# Altium schematic sheet Main.SchDoc
size A4
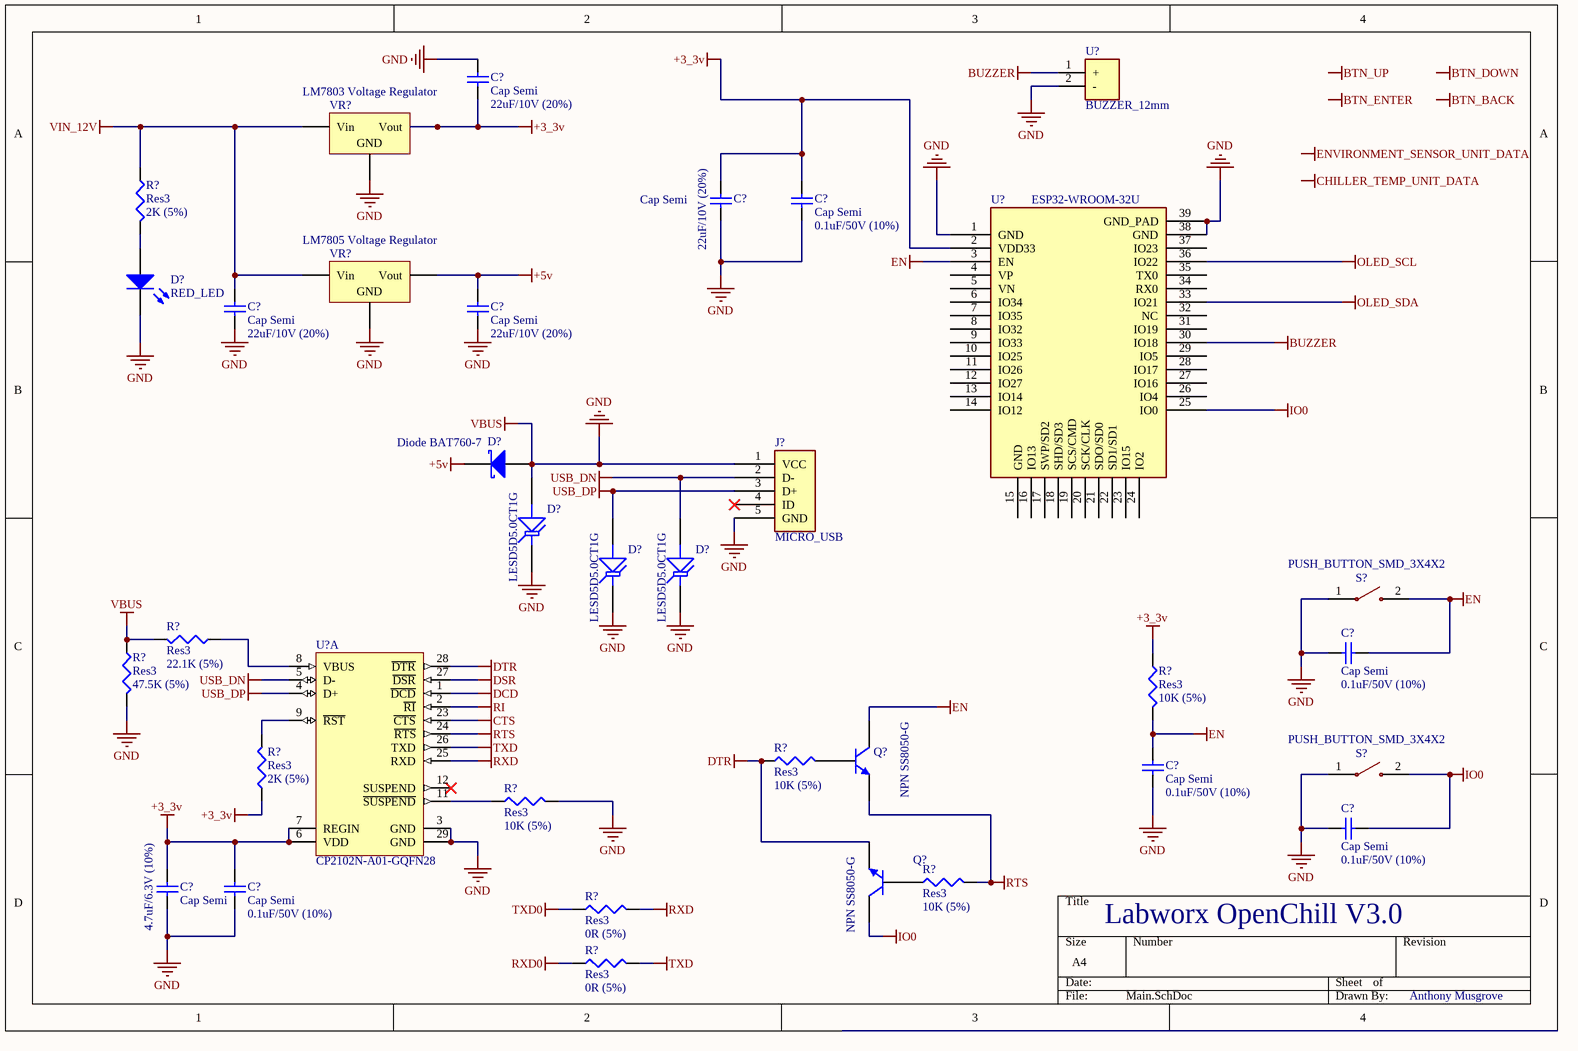
[diagram p0: Main.SchDoc]

## Parts
(Parts that share a designator on the sheet are numbered #1, #2 ... from top to bottom, then left to right.)
C?#1  Cap Semi  value 22uF/10V (20%)  [1608[0603]]
C?#2  Cap Semi  value 22uF/10V (20%)  [1608[0603]]
C?#3  Cap Semi  value 0.1uF/50V (10%)  [1608[0603]]
C?#4  Cap Semi  value 22uF/10V (20%)  [1608[0603]]
C?#5  Cap Semi  value 22uF/10V (20%)  [1608[0603]]
C?#6  Cap Semi  value 0.1uF/50V (10%)  [1608[0603]]
C?#7  Cap Semi  value 0.1uF/50V (10%)  [1608[0603]]
C?#8  Cap Semi  value 0.1uF/50V (10%)  [1608[0603]]
C?#9  Cap Semi  value 4.7uF/6.3V (10%)  [1608[0603]]
C?#10  Cap Semi  value 0.1uF/50V (10%)  [1608[0603]]
D?#1  RED_LED  [3.2X1.6X1.1]
D?#2  Diode BAT760-7  [SOT-23_N]
D?#3  LESD5D5.0CT1G  [SODFL160X70-2N]
D?#4  LESD5D5.0CT1G  [SODFL160X70-2N]
D?#5  LESD5D5.0CT1G  [SODFL160X70-2N]
J?  MICRO_USB  [MICRO_USB]
Q?#1  NPN SS8050-G  [SOT-23B_N]
Q?#2  NPN SS8050-G  [SOT-23B_N]
R?#1  Res3  value 2K (5%)  [J1-0603]
R?#2  Res3  value 47.5K (5%)  [J1-0603]
R?#3  Res3  value 22.1K (5%)  [J1-0603]
R?#4  Res3  value 10K (5%)  [J1-0603]
R?#5  Res3  value 10K (5%)  [J1-0603]
R?#6  Res3  value 2K (5%)  [J1-0603]
R?#7  Res3  value 10K (5%)  [J1-0603]
R?#8  Res3  value 10K (5%)  [J1-0603]
R?#9  Res3  value 0R (5%)  [J1-0603]
R?#10  Res3  value 0R (5%)  [J1-0603]
S?#1  PUSH_BUTTON_SMD_3X4X2  [PUSH_BUTTON_SMD_3X4X2]
S?#2  PUSH_BUTTON_SMD_3X4X2  [PUSH_BUTTON_SMD_3X4X2]
U?#1  BUZZER_12mm  [BUZZER_12mm]
U?#2  ESP32-WROOM-32U  [ESP32-WROOM-32U]
U?#3  CP2102N-A01-GQFN28  [SLAB-QFN-28-3125x3125TP_N]  (part A of 2)
VR?#1  LM7803 Voltage Regulator  [TO-220-AB]
VR?#2  LM7805 Voltage Regulator  [TO-220-AB]

## Nets
+3_3v: C?#1.1 C?#2.2 C?#3.2 C?#9.2 C?#10.2 R?#4.1 R?#6.1 U?#2.2(VDD33) U?#3.6(VDD) U?#3.7(REGIN) VR?#1.3(Vout)
+5v: C?#5.2 D?#2.3(K) VR?#2.3(Vout)
BUZZER: U?#1.1(+) U?#2.30(IO18)
CTS: U?#3.23(~{CTS})
DCD: U?#3.1(~{DCD})
DSR: U?#3.27(~{DSR})
DTR: Q?#2.3(E) R?#5.1 U?#3.28(~{DTR})
EN: C?#6.2 C?#7.2 Q?#1.1(C) R?#4.2 S?#1.2 U?#2.3(EN)
GND: C?#1.2 C?#2.1 C?#3.1 C?#4.1 C?#5.1 C?#6.1 C?#7.1 C?#8.1 C?#9.1 C?#10.1 D?#1.2(K) D?#2.1(A) D?#3.1(A) D?#3.2(K) D?#4.2(K) D?#5.2(K) J?.1(VCC) J?.5(GND) R?#2.1 R?#2.2 R?#3.2 R?#7.2 S?#1.1 S?#2.1 U?#1.2(-) U?#2.1(GND) U?#2.38(GND) U?#2.39(GND_PAD) U?#3.3(GND) U?#3.29(GND) VR?#1.2(GND) VR?#2.2(GND)  [also labelled VBUS]
IO0: C?#8.2 Q?#2.1(C) S?#2.2 U?#2.25(IO0)
OLED_SCL: U?#2.36(IO22)
OLED_SDA: U?#2.33(IO21)
RI: U?#3.2(~{RI})
RTS: Q?#1.3(E) R?#8.2 U?#3.24(~{RTS})
RXD: R?#9.2 U?#3.25(RXD)
RXD0: R?#10.1
TXD: R?#10.2 U?#3.26(TXD)
TXD0: R?#9.1
USB_DN: D?#5.1(A) J?.2(D-) U?#3.5(D-)
USB_DP: D?#4.1(A) J?.3(D+) U?#3.4(D+)
VIN_12V: C?#4.2 R?#1.1 VR?#1.1(Vin) VR?#2.1(Vin)
NetD?#1_1: D?#1.1(A) R?#1.2
NetQ?#1_2: Q?#1.2(B) R?#5.2
NetQ?#2_2: Q?#2.2(B) R?#8.1
NetR?#3_1: R?#3.1 U?#3.8(VBUS)
NetR?#6_2: R?#6.2 U?#3.9(~{RST})
NetR?#7_1: R?#7.1 U?#3.11(~{SUSPEND})

Not connected (* = marked no-connect by the designer): J? 4(ID)*; U?#2 4(VP) 5(VN) 6(IO34) 7(IO35) 8(IO32) 9(IO33) 10(IO25) 11(IO26) 12(IO27) 13(IO14) 14(IO12) 15(GND) 16(IO13) 17(SWP/SD2) 18(SHD/SD3) 19(SCS/CMD) 20(SCK/CLK) 21(SDO/SD0) 22(SD1/SD1) 23(IO15) 24(IO2) 26(IO4) 27(IO16) 28(IO17) 29(IO5) 31(IO19) 32(NC) 34(RX0) 35(TX0) 37(IO23); U?#3 12(SUSPEND)*

## Notes on the sheet
- Labworx OpenChill V3.0
- Anthony Musgrove
- Labels drawn without touching a wire or pin: BTN_BACK, BTN_DOWN, BTN_ENTER, BTN_UP, CHILLER_TEMP_UNIT_DATA, ENVIRONMENT_SENSOR_UNIT_DATA

## Library data of the parts
C?#1-C?#10 = Cap Semi: Capacitor (Semiconductor SIM Model); Published: 8-Jun-2000; LatestRevisionDate: 29-May-2009; LatestRevisionNote: IPC-7351 Footprint Added.; PackageReference: C1206; Publisher: Altium Limited; PackageDescription: Chip Capacitor
D?#1 = LED2: Typical RED, GREEN, YELLOW, AMBER GaAs LED; Published: 8-Jun-2000; LatestRevisionDate: 17-Jul-2002; LatestRevisionNote: Re-released for DXP Platform.; PackageVersion: Feb-2002; PackageReference: 3.2X1.6X1.1; Publisher: Altium Limited; PackageDescription: SM LED; 2 Flat Leads
D?#2 = Diode BAT17: Silicon RF Schottky Diode for Mixer Applications in the VHF/UHF Range; Note: Pin 2 is not connected and not drawn.; Published: 21-Mar-2003; LatestRevisionDate: 29-May-2009; LatestRevisionNote: IPC-7351 Footprint Added.; DatasheetVersion: Oct-1999; PackageVersion: Sep-2001; PackageReference: SOT-23; Publisher: Altium Limited; PackageDescription: 3-Pin SOT-23 Package 0.95 mm Pitch, 2.5 mm Lead Span; ComponentLink1Description: Manufacturer Link; ComponentLink1URL: http://www.infineon.com/; ComponentLink2Description: Datasheet; ComponentLink2URL: http://www.infineon.com/upload/Document/cmc_upload/documents/009/363/bat17series.pdf
D?#3-D?#5 = Tranzorb: LESD5D5.0CT1G Transient Voltage Suppressors for ESD Protection; Published: 24-Mar-1999; LatestRevisionDate: 17-Jul-2002; LatestRevisionNote: Re-released for DXP Platform.; PackageReference: DO-7; Publisher: Altium Limited; PackageDescription: Axial Lead Diode
J? = MICRO_USB: MICRO USB Connector SMD.; JLCPCB PN: C145792
Q?#1 Q?#2 = QNPN: NPN Bipolar Transistor SS8050-G; Published: 8-Jun-2000; LatestRevisionDate: 29-May-2009; LatestRevisionNote: IPC-7351 Footprint Added.; PackageVersion: Aug-1999; PackageReference: SOT-23B; Publisher: Altium Limited; PackageDescription: 3-Pin SOT-23 Package 0.95 mm Pitch, 2.4 mm Lead Span
R?#1-R?#10 = Res3: Resistor; Published: 8-Jun-2000; LatestRevisionDate: 29-May-2009; LatestRevisionNote: IPC-7351 Footprint Added.; PackageReference: J1-0603; Publisher: Altium Limited; PackageDescription: Chip Resistor
S?#1 S?#2 = PUSH_BUTTON_SMD_3X4X2: Push Button Tactile Switch SMD 2 Pins 3x4x2mm.; JLCPCB PN: C231644
U?#1 = BUZZER_12mm: BUZZER MAGNETIC 12MM; Digikey PN: 433-WT-1209T-ND; Mouser PN: 433-WT-1209T-ND; JLCPCB PN: C781866
U?#2 = ESP32-WROOM-32U: Chip SMD 39 Pads Wifi 2.4GHz BLE 4.2 18x19.2mm w/o Antenna.
U?#3 = CMP-0511-00012-1: Single-Chip USB to UART Bridge, 1024 Bytes EEPROM, -40 to 85 degC, 28-pin QFN, Tube; Manufacturer: Silicon Labs; PartNumber: CP2102-GM; Internal Oscillator: TRUE; Sub-Family: USB Bridges; ComponentLink3Description: Package Specification; PackageDescription: 28-Pin Quad-Flat No-Leads Package, Body 5 x 5 mm, Pitch 0.5 mm; EEPROM: 1024 Bytes; Mounting Technology: Surface Mount; ComponentLink2URL: http://www.silabs.com/Support%20Documents/TechnicalDocs/CP2102-9.pdf; DatasheetVersion: Rev. 1.5; ComponentLink1URL: http://www.silabs.com/; ComponentLink2Description: Datasheet; Code_JEDEC: MO-220; PackageReference: QFN-28; Code_IPC: J-STD-020C; ComponentLink3URL: http://www.silabs.com/Support%20Documents/TechnicalDocs/C8051T61x.pdf; ComponentLink1Description: Manufacturer URL; Manufacturer Part Number: CP2102-GM
VR?#1 = Volt Reg: Published: 24-Mar-1999; LatestRevisionDate: 29-May-2009; LatestRevisionNote: IPC-7351 Footprint Added.; PackageReference: D2PAK; Publisher: Altium Limited; PackageDescription: 3-Pin Transistor Outline Package 2.54 mm Pitch, 15.1 mm Lead Span
VR?#2 = Volt Reg: LM7803 Voltage Regulator; Published: 24-Mar-1999; LatestRevisionDate: 29-May-2009; LatestRevisionNote: IPC-7351 Footprint Added.; PackageReference: D2PAK; Publisher: Altium Limited; PackageDescription: 3-Pin Transistor Outline Package 2.54 mm Pitch, 15.1 mm Lead Span